# EAGLE design BlueESC-Basic (EAGLE 7.1.0)
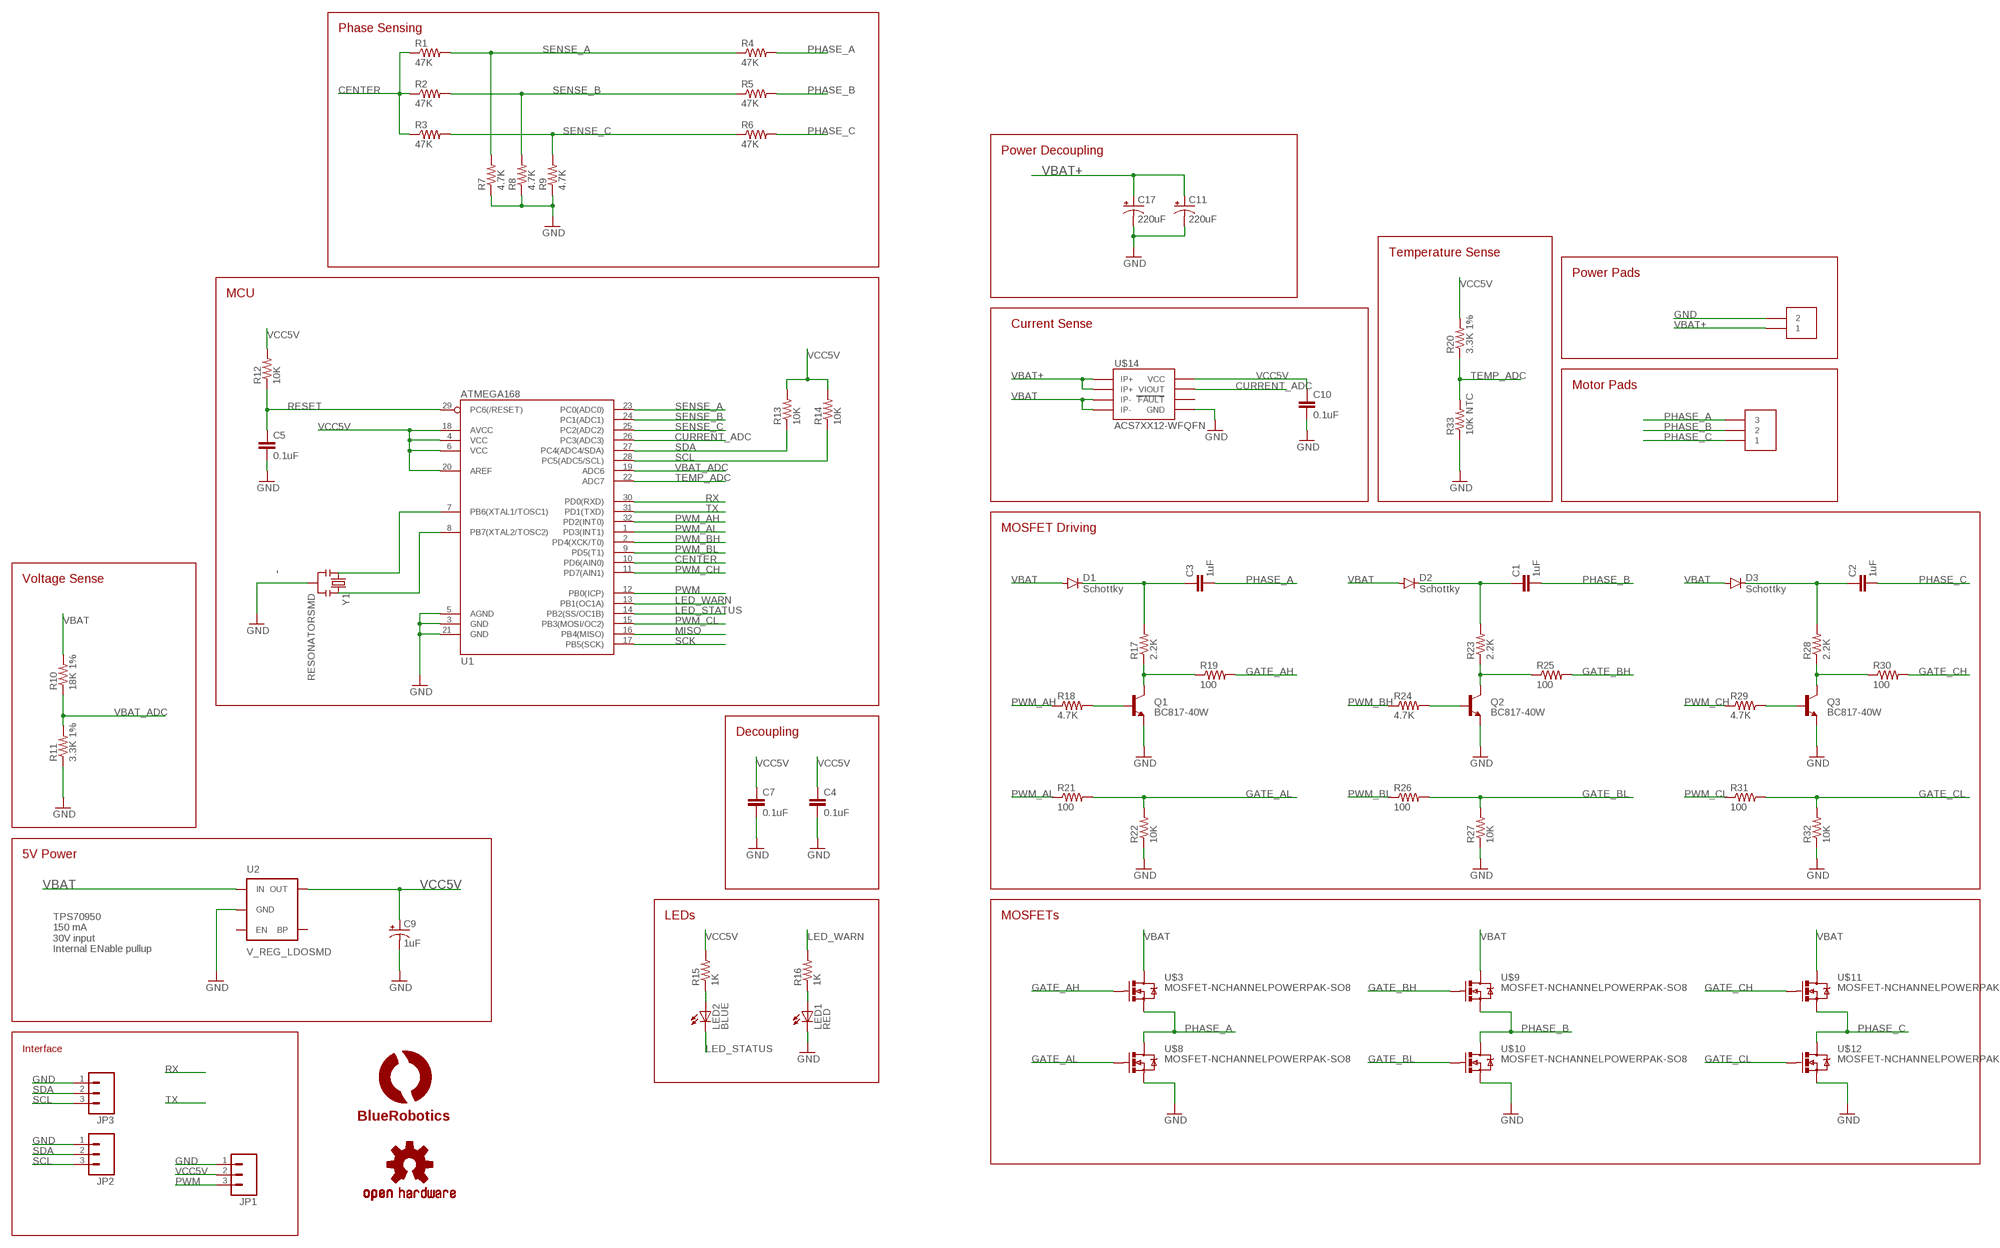
[diagram p0: schematic, sheet 1]

## Parts
C1  1uF  CAP0805  [0805]
C2  1uF  CAP0805  [0805]
C3  1uF  CAP0805  [0805]
C4  0.1uF  CAP0603-CAP  [0603-CAP]
C5  0.1uF  CAP0603-CAP  [0603-CAP]
C7  0.1uF  CAP0603-CAP  [0603-CAP]
C9  1uF  CAP_POL1206  [EIA3216]
C10  0.1uF  CAP0603-CAP  [0603-CAP]
C11  220uF  CAP_POLE  [PANASONIC_E]
C17  220uF  CAP_POLE  [PANASONIC_E]
D1  Schottky  DIODESOD  [SOD-323]
D2  Schottky  DIODESOD  [SOD-323]
D3  Schottky  DIODESOD  [SOD-323]
JP1  M03PTH  [1X03]
JP2  M03PTH  [1X03]
JP3  M03PTH  [1X03]
LED1  RED  LED0603  [LED-0603]
LED2  BLUE  LED0603  [LED-0603]
LOGO1  OSHW-LOGOS  [OSHW-LOGO-S]
Q1  BC817-40W  TRANSISTOR_NPNSOT23  [SOT23]
Q2  BC817-40W  TRANSISTOR_NPNSOT23  [SOT23]
Q3  BC817-40W  TRANSISTOR_NPNSOT23  [SOT23]
R1  47K  33KOHM1/10W1%(0603)  [0603-RES]
R2  47K  33KOHM1/10W1%(0603)  [0603-RES]
R3  47K  33KOHM1/10W1%(0603)  [0603-RES]
R4  47K  33KOHM1/10W1%(0603)  [0603-RES]
R5  47K  33KOHM1/10W1%(0603)  [0603-RES]
R6  47K  33KOHM1/10W1%(0603)  [0603-RES]
R7  4.7K  RESISTOR0603  [0603-RES]
R8  4.7K  RESISTOR0603  [0603-RES]
R9  4.7K  RESISTOR0603  [0603-RES]
R10  18K 1%  33KOHM1/10W1%(0603)  [0603-RES]
R11  3.3K 1%  33KOHM1/10W1%(0603)  [0603-RES]
R12  10K  33KOHM1/10W1%(0603)  [0603-RES]
R13  10K  33KOHM1/10W1%(0603)  [0603-RES]
R14  10K  33KOHM1/10W1%(0603)  [0603-RES]
R15  1K  RESISTOR0603-RES  [0603-RES]
R16  1K  RESISTOR0603-RES  [0603-RES]
R17  2.2K  33KOHM1/10W1%(0603)  [0603-RES]
R18  4.7K  33KOHM1/10W1%(0603)  [0603-RES]
R19  100  33KOHM1/10W1%(0603)  [0603-RES]
R20  3.3K 1%  33KOHM1/10W1%(0603)  [0603-RES]
R21  100  33KOHM1/10W1%(0603)  [0603-RES]
R22  10K  33KOHM1/10W1%(0603)  [0603-RES]
R23  2.2K  33KOHM1/10W1%(0603)  [0603-RES]
R24  4.7K  33KOHM1/10W1%(0603)  [0603-RES]
R25  100  33KOHM1/10W1%(0603)  [0603-RES]
R26  100  33KOHM1/10W1%(0603)  [0603-RES]
R27  10K  33KOHM1/10W1%(0603)  [0603-RES]
R28  2.2K  33KOHM1/10W1%(0603)  [0603-RES]
R29  4.7K  33KOHM1/10W1%(0603)  [0603-RES]
R30  100  33KOHM1/10W1%(0603)  [0603-RES]
R31  100  33KOHM1/10W1%(0603)  [0603-RES]
R32  10K  33KOHM1/10W1%(0603)  [0603-RES]
R33  10K NTC  33KOHM1/10W1%(0603)  [0603-RES]
U1  ATMEGA168  [TQFP32-08]
U2  V_REG_LDOSMD  [SOT23-5]
U$3  MOSFET-NCHANNELPOWERPAK-SO8  [POWERPAK-SO8]
U$4  LOGOBR-LOGO-M  [BR-LOGO-MEDIUM]
U$8  MOSFET-NCHANNELPOWERPAK-SO8  [POWERPAK-SO8]
U$9  MOSFET-NCHANNELPOWERPAK-SO8  [POWERPAK-SO8]
U$10  MOSFET-NCHANNELPOWERPAK-SO8  [POWERPAK-SO8]
U$11  MOSFET-NCHANNELPOWERPAK-SO8  [POWERPAK-SO8]
U$12  MOSFET-NCHANNELPOWERPAK-SO8  [POWERPAK-SO8]
U$14  ACS7XX12-WFQFN  [12-WFQFN]
U$15  HEADER-2BARRIER-BLOCK-1  [OSTYK33102030]
U$16  HEADER-3BARRIER-BLOCK-1  [OSTYK33103030]
Y1  RESONATORSMD  [RESONATOR-SMD]

## Nets
CENTER: R1.1 R2.1 R3.1 U1.10(PD6(AIN0))
CURRENT_ADC: U1.26(PC3(ADC3)) U$14.VIOUT
GATE_AH: R19.2 U$3.4(G)
GATE_AL: R21.2 R22.2 U$8.4(G)
GATE_BH: R25.2 U$9.4(G)
GATE_BL: R26.2 R27.2 U$10.4(G)
GATE_CH: R30.2 U$11.4(G)
GATE_CL: R31.2 R32.2 U$12.4(G)
GND: C4.2 C5.2 C7.2 C9.C(-) C10.2 C11.- C17.- JP2.1 JP3.1 LED1.C Q1.2(E) Q2.2(E) Q3.2(E) R7.1 R8.1 R9.1 R11.1 R22.1 R27.1 R32.1 R33.1 U1.3(GND) U1.5(AGND) U1.21(GND) U2.2(GND) U$8.1(S) U$8.2(S) U$8.3(S) U$10.1(S) U$10.2(S) U$10.3(S) U$12.1(S) U$12.2(S) U$12.3(S) U$14.GND U$15.2 Y1.2
LED_STATUS: LED2.C U1.14(PB2(SS/OC1B))
LED_WARN: R16.2 U1.13(PB1(OC1A))
MISO: U1.16(PB4(MISO))
N$2: Q1.1(B) R18.2
N$3: LED1.A R16.1
N$4: Q1.3(C) R17.1 R19.1
N$5: Q2.1(B) R24.2
N$6: Q2.3(C) R23.1 R25.1
N$7: Q3.1(B) R29.2
N$9: Q3.3(C) R28.1 R30.1
N$10: U1.7(PB6(XTAL1/TOSC1)) Y1.1
N$11: U1.8(PB7(XTAL2/TOSC2)) Y1.3
N$12: C3.1 D1.C R17.2
N$15: C1.1 D2.C R23.2
N$16: LED2.A R15.1
N$19: C2.1 D3.C R28.2
PHASE_A: C3.2 R4.2 U$3.1(S) U$3.2(S) U$3.3(S) U$8.5(D) U$8.6(D) U$8.7(D) U$8.8(D) U$8.9(D) U$16.3
PHASE_B: C1.2 R5.2 U$9.1(S) U$9.2(S) U$9.3(S) U$10.5(D) U$10.6(D) U$10.7(D) U$10.8(D) U$10.9(D) U$16.2
PHASE_C: C2.2 R6.2 U$11.1(S) U$11.2(S) U$11.3(S) U$12.5(D) U$12.6(D) U$12.7(D) U$12.8(D) U$12.9(D) U$16.1
PWM: U1.12(PB0(ICP))
PWM_AH: R18.1 U1.32(PD2(INT0))
PWM_AL: R21.1 U1.1(PD3(INT1))
PWM_BH: R24.1 U1.2(PD4(XCK/T0))
PWM_BL: R26.1 U1.9(PD5(T1))
PWM_CH: R29.1 U1.11(PD7(AIN1))
PWM_CL: R31.1 U1.15(PB3(MOSI/OC2))
RESET: C5.1 R12.1 U1.29(PC6(/RESET))
RX: U1.30(PD0(RXD))
SCK: U1.17(PB5(SCK))
SCL: JP2.3 JP3.3 R14.1 U1.28(PC5(ADC5/SCL))
SDA: JP2.2 JP3.2 R13.1 U1.27(PC4(ADC4/SDA))
SENSE_A: R1.2 R4.1 R7.2 U1.23(PC0(ADC0))
SENSE_B: R2.2 R5.1 R8.2 U1.24(PC1(ADC1))
SENSE_C: R3.2 R6.1 R9.2 U1.25(PC2(ADC2))
TEMP_ADC: R20.1 R33.2 U1.22(ADC7)
TX: U1.31(PD1(TXD))
VBAT: D1.A D2.A D3.A R10.2 U2.1(IN) U$3.5(D) U$3.6(D) U$3.7(D) U$3.8(D) U$3.9(D) U$9.5(D) U$9.6(D) U$9.7(D) U$9.8(D) U$9.9(D) U$11.5(D) U$11.6(D) U$11.7(D) U$11.8(D) U$11.9(D) U$14.IP-1 U$14.IP-2
VBAT+: C11.+ C17.+ U$14.IP+1 U$14.IP+2 U$15.1
VBAT_ADC: R10.1 R11.2 U1.19(ADC6)
VCC5V: C4.1 C7.1 C9.A(+) C10.1 R12.2 R13.2 R14.2 R15.2 R20.2 U1.4(VCC) U1.6(VCC) U1.18(AVCC) U1.20(AREF) U2.5(OUT) U$14.VCC
Unconnected: JP1.1 JP1.2 JP1.3 U2.3(EN) U2.4(BP) U$14.FAULT

## Notes on the sheet
- Phase Sensing
- Power Decoupling
- Temperature Sense
- Power Pads
- MCU
- Current Sense
- Motor Pads
- MOSFET Driving
- Voltage Sense
- Decoupling
- 5V Power
- LEDs | MOSFETs
- TPS70950
  150 mA
  30V input
  Internal ENable pullup
- Interface

## Library data of the parts
C1-C5 C7 C10 = SparkFun-Capacitors:CAP: Capacitor Standard 0603 ceramic capacitor, and 0.1" leaded capacitor.
C9 C11 C17 = SparkFun-Capacitors:CAP_POL: Capacitor Polarized These are standard SMD and PTH capacitors. Normally 10uF, 47uF, and 100uF in electrolytic and tantalum varieties. Always verify the external diameter of the through hole cap, it varies with capacity, voltage, and manufacturer. The EIA devices should be standard.
D1-D3 = SparkFun-DiscreteSemi:DIODE: Diode These are standard reverse protection diodes and small signal diodes. SMA package can handle up to about 1A. SOD-323 can handle about 200mA. What the SOD-323 package when ordering, there are some mfgs out there that are 5-pin packages.; PROD_ID: DIO-09646
JP1-JP3 = SparkFun-Connectors:M03: Header 3 Standard 3-pin 0.1" header. Use with straight break away headers (SKU : PRT-00116), right angle break away headers (PRT-00553), swiss pins (PRT-00743), machine pins (PRT-00117), and female headers (PRT-00115). Molex polarized connector foot print use with SKU : PRT-08232 with associated crimp pins and housings.
LED1 LED2 = SparkFun:LED: LEDs Standard schematic elements and footprints for 5mm, 3mm, 1206, and 0603 sized LEDs. 5mm - Spark Fun Electronics SKU : COM-00529 (and others)
LOGO1 = SparkFun-Aesthetics:OSHW-LOGO: Open Source Hardware Logo This logo indicates the piece of hardware it is found on incorporates a OSHW license and/or adheres to the definition of open source hardware found here: http://freedomdefined.org/OSHW
Q1-Q3 = SparkFun-DiscreteSemi:TRANSISTOR_NPN: Generic NPN BJT MMBT2222A - TRANS-08049 (SOT-23, 1A 40V) MPSA42 - TRANS-09116 (SOT-23, 500mA 300V) MMBT5088LT1G - TRANS-11160 (SOT-23, 50 mA 30V) BC547 - COM-08928 <http://www.sparkfun.com/products/8928> (TO-92 45V 100mA) (1.Collector 2.Base 3.Emitter) 2N3904 - COM-00521 <http://www.sparkfun.com/products/521> (TO-92 40V 200mA) (1.Emitter 2.Base 3.Collector) P2N2222A - COM-12852 <http://www.sparkfun.com/products/12852> (TO-92 40V 600mA) (1.Collector 2.Base 3.Emitter)
R1-R6 R10-R14 R17-R33 = SparkFun-Resistors:33KOHM1/10W1%(0603): RES-08416
R7-R9 = SparkFun-Resistors:RESISTOR: Resistor Basic schematic elements and footprints for 0603, 1206, and PTH resistors.
R15 R16 = SparkFun:RESISTOR: Resistor Basic schematic elements and footprints for 0603, 1206, and PTH resistors.
U1 = SparkFun-DigitalIC:ATMEGA168: Atmel 32-pin 8-bit micro, 16k flash.
U2 = SparkFun-PowerIC:V_REG_LDO: Voltage Regulator LDO Standard 150mA LDO voltage regulator in SOT-23 layout. Micrel part MIC5205. BP (by-pass) pin is used to lower output noise with 470pF cap.
U$3 U$8-U$12 = BR-Eagle-Library:MOSFET-NCHANNEL
U$4 = BR-Eagle-Library:LOGO
U$14 = BR-Eagle-Library:ACS7XX
U$15 = BR-Eagle-Library:HEADER-2
U$16 = BR-Eagle-Library:HEADER-3
Y1 = SparkFun:RESONATOR: Resonator Small SMD resonator. This is the itty bitty 10/20MHz resonators with built in caps. CSTCE10M0G55 and CSTCE20M0V53. Footprint has been reviewed closely but hasn't been tested yet.

## Board
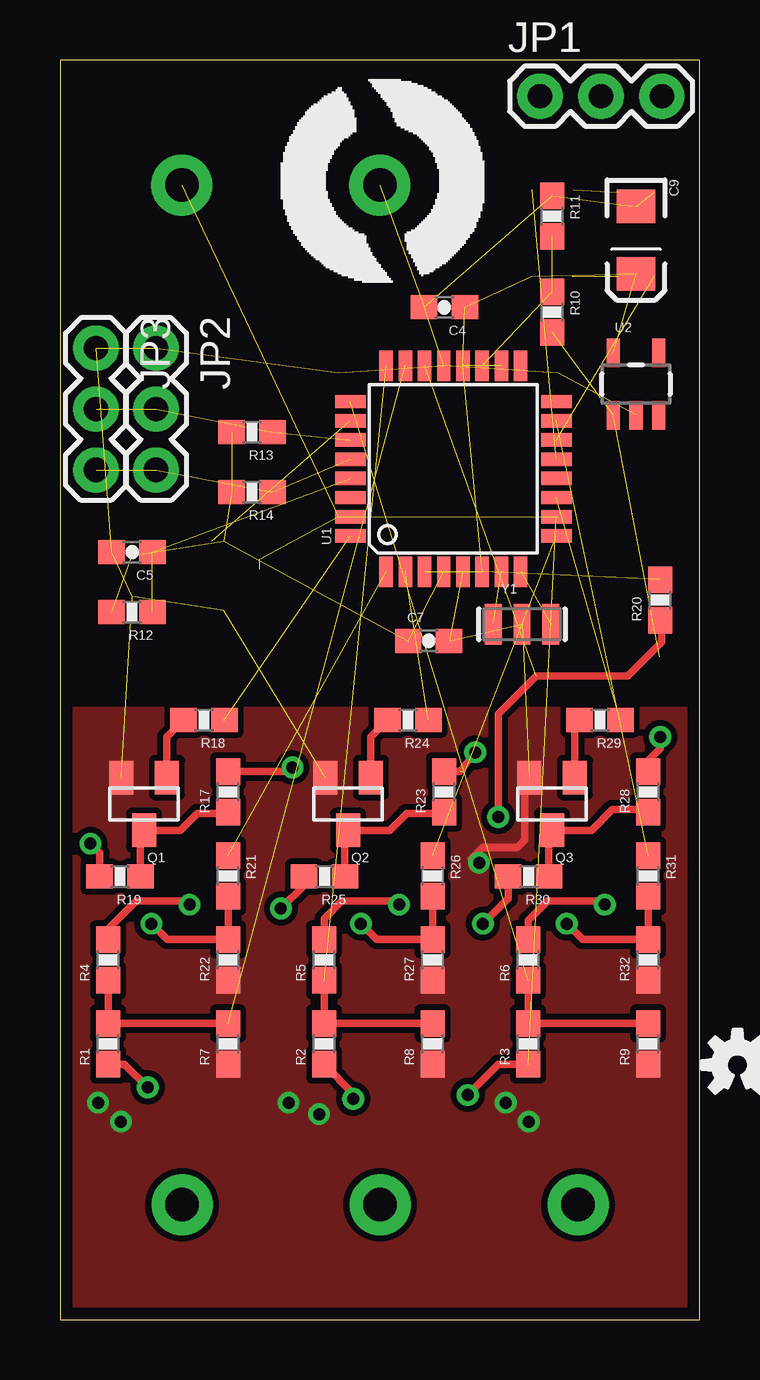
[diagram p1: board, top side]
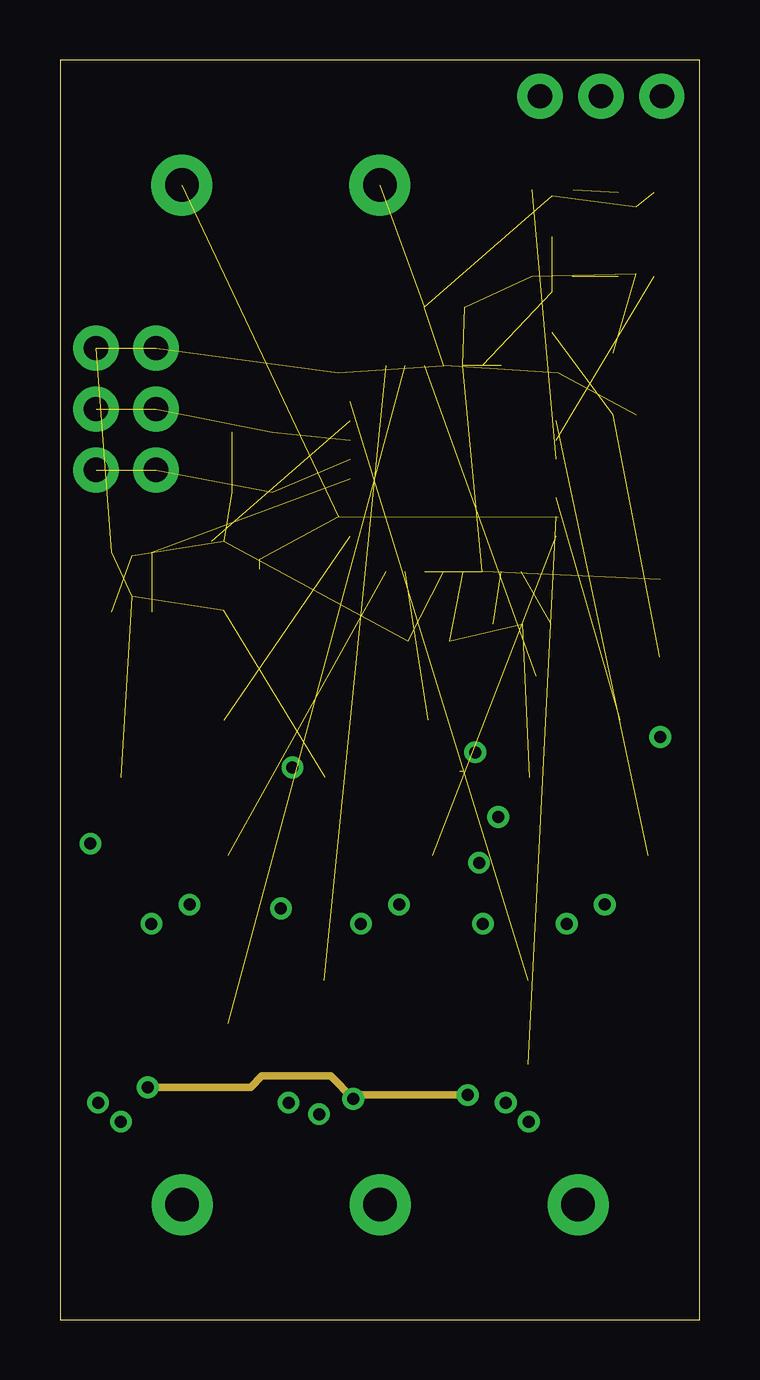
[diagram p2: board, inner layer Route2]
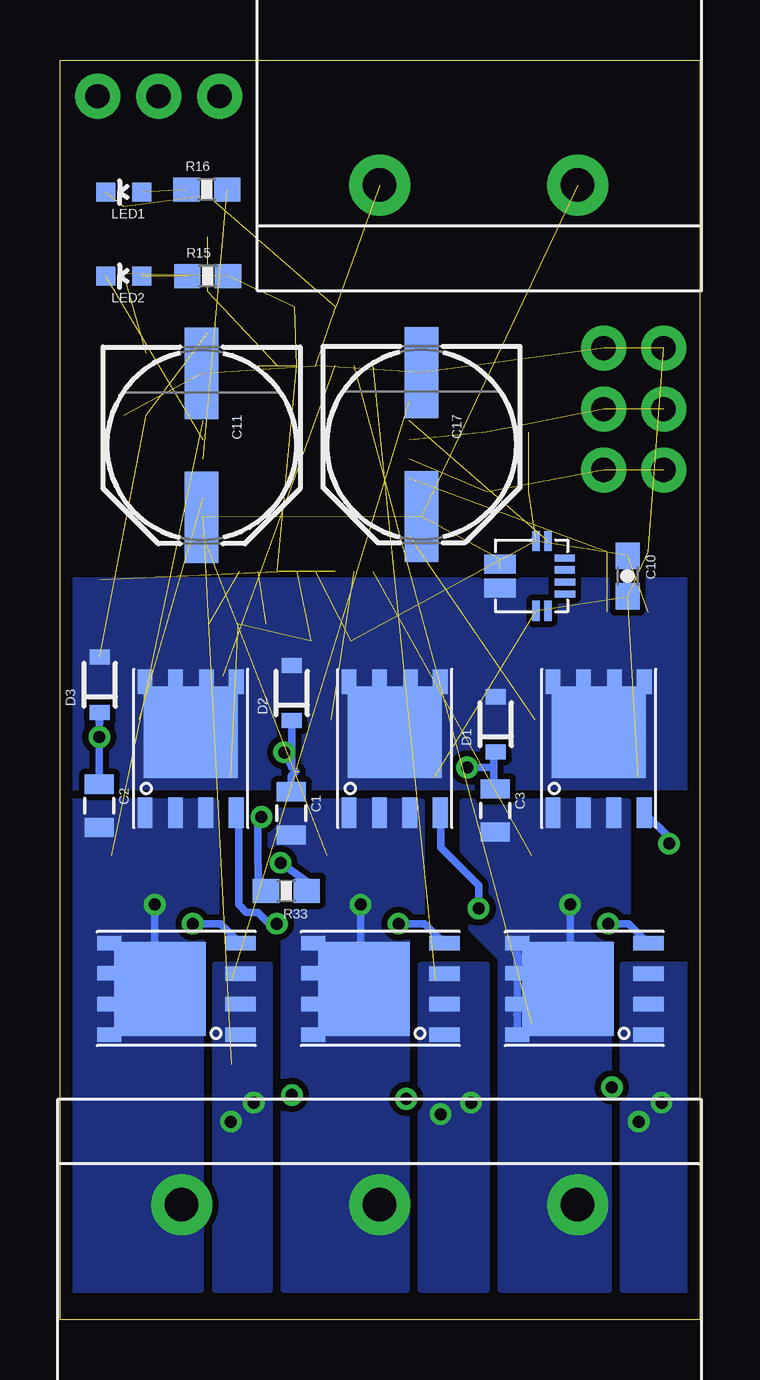
[diagram p3: board, bottom side, seen from below]

Size 26.65 x 52.51 mm. Coordinates in mm from the lower left corner, seen from the top.
Outline: 0,0 26.65,0 26.65,52.51 0,52.51 0,0
Copper layers (1*2*15*16): Top 0.035mm / dielectric 1.5mm / Route2 0.035mm / dielectric 0.15mm / Route15 0.035mm / dielectric 0.2mm / Bottom 0.035mm
Design rules "default *": minimum track width 10mil, minimum drill 16mil, track to track 8mil, track to pad 8mil, pad to pad 8mil, via to via 8mil, smd to smd 8mil, copper to edge 20mil, drill to drill 8mil, minimum pad ring 10mil, minimum via ring 8mil, stop-mask expansion 4mil, vias tented up to drill 0mil, thermal gap 10mil

### Footprints (pad centres in the part's own frame; a part is rotated, then mirrored left to right if it is on the bottom)
0805 = smd 0.8 x 1.2: 1 -0.9,0; 2 0.9,0
0603-CAP = smd 1.1 x 1: 1 -0.85,0; 2 0.85,0
EIA3216 = smd 1.4 x 1.6: A 1.4,0; C -1.4,0
PANASONIC_E = smd 3.8 x 1.4: + 3,0; - -3,0
SOD-323 = smd 0.63 x 0.83: A 1.15,0; C -1.15,0
1X03 = drill 1.016 pad 1.88: 1 0,0; 2 2.54,0; 3 5.08,0
LED-0603 = smd 0.8 x 0.8: A 0,-0.75; C 0,0.75
SOT23 = smd 1 x 1.4: 1 -0.95,-1.1; 2 0.95,-1.1; 3 0,1.1
0603-RES = smd 1.1 x 1: 1 -0.85,0; 2 0.85,0
TQFP32-08 = smd 1.27 x 0.559: 1 -4.293,2.8; 2 -4.293,2; 3 -4.293,1.2; 4 -4.293,0.4; 5 -4.293,-0.4; 6 -4.293,-1.2; 7 -4.293,-2; 8 -4.293,-2.8; 17 4.293,-2.8; 18 4.293,-2; 19 4.293,-1.2; 20 4.293,-0.4; 21 4.293,0.4; 22 4.293,1.2; 23 4.293,2; 24 4.293,2.8 | smd 0.559 x 1.27: 9 -2.8,-4.293; 10 -2,-4.293; 11 -1.2,-4.293; 12 -0.4,-4.293; 13 0.4,-4.293; 14 1.2,-4.293; 15 2,-4.293; 16 2.8,-4.293; 25 2.8,4.293; 26 2,4.293; 27 1.2,4.293; 28 0.4,4.293; 29 -0.4,4.293; 30 -1.2,4.293; 31 -2,4.293; 32 -2.8,4.293
SOT23-5 = smd 0.55 x 1.2: 1 -0.95,-1.3; 2 0,-1.3; 3 0.95,-1.3; 4 0.95,1.3; 5 -0.95,1.3
POWERPAK-SO8 = smd 1.27 x 0.61: 1 0.635,4.115; 2 0.635,2.845; 3 0.635,1.575; 4 0.635,0.305 | smd 1.016 x 0.61: 5 6.096,0.305; 6 6.096,1.549; 7 6.096,2.845; 8 6.096,4.115 | smd 3.81 x 3.912: 9 3.988,2.21
12-WFQFN = smd 0.3 x 0.85: FAULT 0.683,-1.445; GND 0.185,-1.446; VCC 0.183,1.456; VIOUT 0.683,1.456 | smd 1.3 x 0.4: IP+1 -1.317,0.705; IP+2 -1.315,0.301; IP-1 -1.317,-0.295; IP-2 -1.317,-0.699 | smd 0.85 x 0.3: NC1 1.383,0.754; NC2 1.383,0.256; NC3 1.384,-0.245; NC4 1.385,-0.745
OSTYK33102030 = drill 1.4 pad 2.54: 1 8.25,0; 2 0,0
OSTYK33103030 = drill 1.4 pad 2.54: 1 8.25,0; 2 0,0; 3 -8.25,0
RESONATOR-SMD = smd 0.7 x 1.7: 1 -1.2,0; 2 0,0; 3 1.2,0

### Placement (x,y rotation side)
C1  17.01,21.11 270 bottom
C2  25.01,21.42 270 bottom
C3  8.51,21.23 270 bottom
C4  16.02,42.2 180 top
C5  3,32 180 top
C7  15.36,28.3 0 top
C9  24,45 270 top
C10  3,31 270 bottom
C11  20.75,36.45 270 bottom
C17  11.59,36.48 270 bottom
D1  8.49,24.82 90 bottom
D2  16.99,26.12 90 bottom
D3  24.99,26.47 90 bottom
JP1  20,51 0 top
JP2  4,40.5 270 top
JP3  1.5,40.5 270 top
LED1  24,47 90 bottom
LED2  24,43.5 90 bottom
LOGO1  28.23,10.62 0 top
Q1  3.5,21.5 180 top
Q2  12,21.5 180 top
Q3  20.5,21.5 180 top
R1  2,11.5 90 top
R2  11,11.5 90 top
R3  19.5,11.5 90 top
R4  2,15 90 top
R5  11,15 90 top
R6  19.5,15 90 top
R7  7,11.5 90 top
R8  15.52,11.5 90 top
R9  24.5,11.5 90 top
R10  20.5,42 270 top
R11  20.5,46 270 top
R12  3,29.5 180 top
R13  8,37 180 top
R14  8,34.5 180 top
R15  20.5,43.5 0 bottom
R16  20.53,47.11 0 bottom
R17  7,22 90 top
R18  6,25 180 top
R19  2.5,18.48 180 top
R20  25,30 90 top
R21  7,18.5 270 top
R22  7,15 90 top
R23  16,22 90 top
R24  14.5,25 180 top
R25  11.02,18.48 180 top
R26  15.52,18.5 270 top
R27  15.52,15 90 top
R28  24.5,22 90 top
R29  22.5,25 180 top
R30  19.52,18.48 180 top
R31  24.5,18.5 270 top
R32  24.5,15 90 top
R33  17.22,17.88 180 bottom
U1  16.39,35.47 90 top
U2  24,39 0 top
U$3  2,20.5 90 bottom
U$4  9.25,43.28 0 top
U$8  1.5,16 180 bottom
U$9  10.5,20.5 90 bottom
U$10  10,16 180 bottom
U$11  19,20.5 90 bottom
U$12  18.5,16 180 bottom
U$14  7,31 0 bottom
U$15  13.33,47.3 0 bottom
U$16  13.34,4.79 180 bottom
Y1  19.25,28.99 0 top

### Tracks (layer width: path | path; a pad name or v marks a point on that pad's centre or on a via)
CENTER  (via drill 0.5)  (1 unrouted)
  Top 0.305: R1.1 2.69,10.65 v3.65,9.68 | v12.22,9.21 12.22,9.43 R2.1 | R3.1 18.27,10.65 v16.99,9.37
  Route2 0.305: v3.65,9.68 7.94,9.68 8.41,10.16 11.27,10.16 v12.22,9.21 12.38,9.37 v16.99,9.37
CURRENT_ADC  (1 unrouted)
GATE_AH  (via drill 0.5)
  Top 0.305: R19.2 1.65,19.46 v1.27,19.84
  Bottom 0.305: v1.27,19.84 1.27,20.1 U$3.4
GATE_AL  (via drill 0.5)
  Top 0.305: R21.2 R22.2 4.47,15.85 v3.81,16.51
  Bottom 0.305: v3.81,16.51 2.95,16.51 U$8.4
GATE_BH  (via drill 0.5)
  Top 0.305: R25.2 10.17,18.11 v9.21,17.14
  Bottom 0.305: v9.21,17.14 9.21,18.1 10.79,19.68 10.79,21.12 U$9.4
GATE_BL  (via drill 0.5)
  Top 0.305: v12.54,16.51 13.2,15.85 R27.2 R26.2
  Bottom 0.305: v12.54,16.51 11.45,16.51 U$10.4
GATE_CH  (via drill 0.5)
  Top 0.305: R30.2 18.67,17.56 v17.62,16.51
  Bottom 0.305: v17.62,16.51 17.94,16.51 18.41,16.99 18.89,16.99 19.21,17.3 19.21,21.04 U$11.4
GATE_CL  (via drill 0.5)
  Top 0.305: v21.11,16.51 21.77,15.85 R32.2 R31.2
  Bottom 0.305: v21.11,16.51 19.95,16.51 U$12.4
GND  (via drill 0.5)  (19 unrouted)
  Top 0.305: v17.46,19.05 17.14,19.21 17.62,19.68 19.05,19.68 19.37,20 19.37,22.42 Q3.2
  Bottom 0.305: R33.1 16.37,18.27 v17.46,19.05
  other vias: 1.59,9.05 2.54,8.26 9.53,9.05 10.79,8.57 18.57,9.05 19.53,8.26
  pour Bottom (isolate 0.254, no thermals): 3.17,1.27 3.17,14.76 -2.54,14.76 -2.54,1.27
  pour Bottom (isolate 0.254, no thermals): 8.89,1.27 8.89,14.76 11.59,14.76 11.59,1.27
  pour Bottom (isolate 0.254, no thermals): 17.94,1.27 17.94,14.76 20.16,14.76 20.16,1.27
  pour Top (isolate 0.254, no thermals): -2.7,1.27 -2.7,25.4 27.94,25.4 27.94,0 -1.59,0 -2.7,1.11
LED_STATUS  (1 unrouted)
LED_WARN  (1 unrouted)
N$2
  Top 0.305: Q1.1 4.45,24.3 R18.2
N$3  (1 unrouted)
N$4
  Top 0.305: R19.1 3.35,20.25 Q1.3 5,20.4 5.71,21.11 6.96,21.11 R17.1
N$5
  Top 0.305: Q2.1 12.95,24.3 R24.2
N$6
  Top 0.305: R25.1 11.87,20.27 Q2.3 13.73,20.4 14.45,21.11 15.96,21.11 R23.1
N$7
  Top 0.305: Q3.1 21.45,24.8 R29.2
N$9
  Top 0.305: R30.1 20.37,20.27 Q3.3 22.15,20.4 23.02,21.27 24.38,21.27 R28.1
N$10  (1 unrouted)
N$11  (1 unrouted)
N$12  (via drill 0.5)
  Top 0.305: R17.2 9.52,22.85 v9.68,23.02
  Bottom 0.305: v9.68,23.02 8.57,23.02 | 8.57,23.02 8.57,23.59 D1.C | 8.57,23.02 8.57,22.19 C3.1
N$15  (via drill 0.5)  (1 unrouted)
  Top 0.305: R23.2 16.66,22.85 v17.3,23.65
  Bottom 0.305: v17.3,23.65 16.99,23.02 16.99,23.86 D2.C | C1.1 17.01,22.67 16.83,22.85
N$16  (1 unrouted)
N$19  (via drill 0.5)
  Top 0.305: R28.2 24.5,23.3 25.01,23.81 v25.01,24.29
  Bottom 0.305: C2.1 25.01,24.03 v25.01,24.29 | v25.01,24.29 D3.C 25.01,25.3 v25.01,24.29
PHASE_A  (via drill 0.5)
  Top 0.305: R4.2 2,16.29 3.17,17.46 5.24,17.46 v5.4,17.3
  Bottom 0.305: v5.4,17.3 5.4,13.88 U$8.9 6.17,13.79 7.6,15.22 | U$8.8 7.6,12.68 7.62,12.7 7.6,12.72 U$8.7 7.6,15.22 | 7.6,15.22 7.62,15.24 7.6,15.26 U$8.5
  pour Bottom (isolate 0.254, no thermals): 3.81,1.27 3.81,15.72 3.02,16.51 3.02,21.59 9.84,21.59 9.84,16.67 8.26,15.08 8.26,1.27
PHASE_B  (via drill 0.5)
  Top 0.305: R5.2 11,16.71 11.75,17.46 13.97,17.46 v14.13,17.3
  Bottom 0.305: v14.13,17.3 14.13,13.93 U$10.9
  pour Bottom (isolate 0.254, no thermals): 12.22,1.27 12.22,16.19 11.59,16.83 11.59,21.59 18.41,21.59 18.41,17.14 17.3,16.03 17.3,1.27
PHASE_C  (via drill 0.5)
  Top 0.305: R6.2 19.5,16.64 20.32,17.46 22.54,17.46 v22.7,17.3
  Bottom 0.305: v22.7,17.3 22.7,14 U$12.9
  pour Bottom (isolate 0.254, no thermals): 20.8,1.27 20.8,16.03 20.16,16.67 20.16,21.59 27.94,21.59 27.94,1.27
PWM_AH  (1 unrouted)
PWM_AL  (1 unrouted)
PWM_BH  (1 unrouted)
PWM_BL  (1 unrouted)
PWM_CH  (1 unrouted)
PWM_CL  (1 unrouted)
RESET  (2 unrouted)
SCL  (3 unrouted)
SDA  (3 unrouted)
SENSE_A  (1 unrouted)
  Top 0.305: R4.1 R1.2 R7.2
SENSE_B  (1 unrouted)
  Top 0.305: R8.2 R2.2 R5.1
SENSE_C  (1 unrouted)
  Top 0.305: R9.2 R3.2 R6.1
TEMP_ADC  (via drill 0.5)  (1 unrouted)
  Top 0.305: v18.26,20.95 18.26,25.24 19.84,26.83 23.65,26.83 25.08,28.26 25.08,29.07 R20.1
  Bottom 0.305: R33.2 18.39,18.07 18.41,20 18.41,20.8 v18.26,20.95
VBAT  (2 unrouted)
  pour Bottom (isolate 0.254, no thermals): -1.27,22.23 28.57,22.23 28.57,30.8 -1.27,30.8
VBAT+  (4 unrouted)
VBAT_ADC  (2 unrouted)
VCC5V  (14 unrouted)